# EAGLE design wander-v7 (EAGLE 9.4.2)
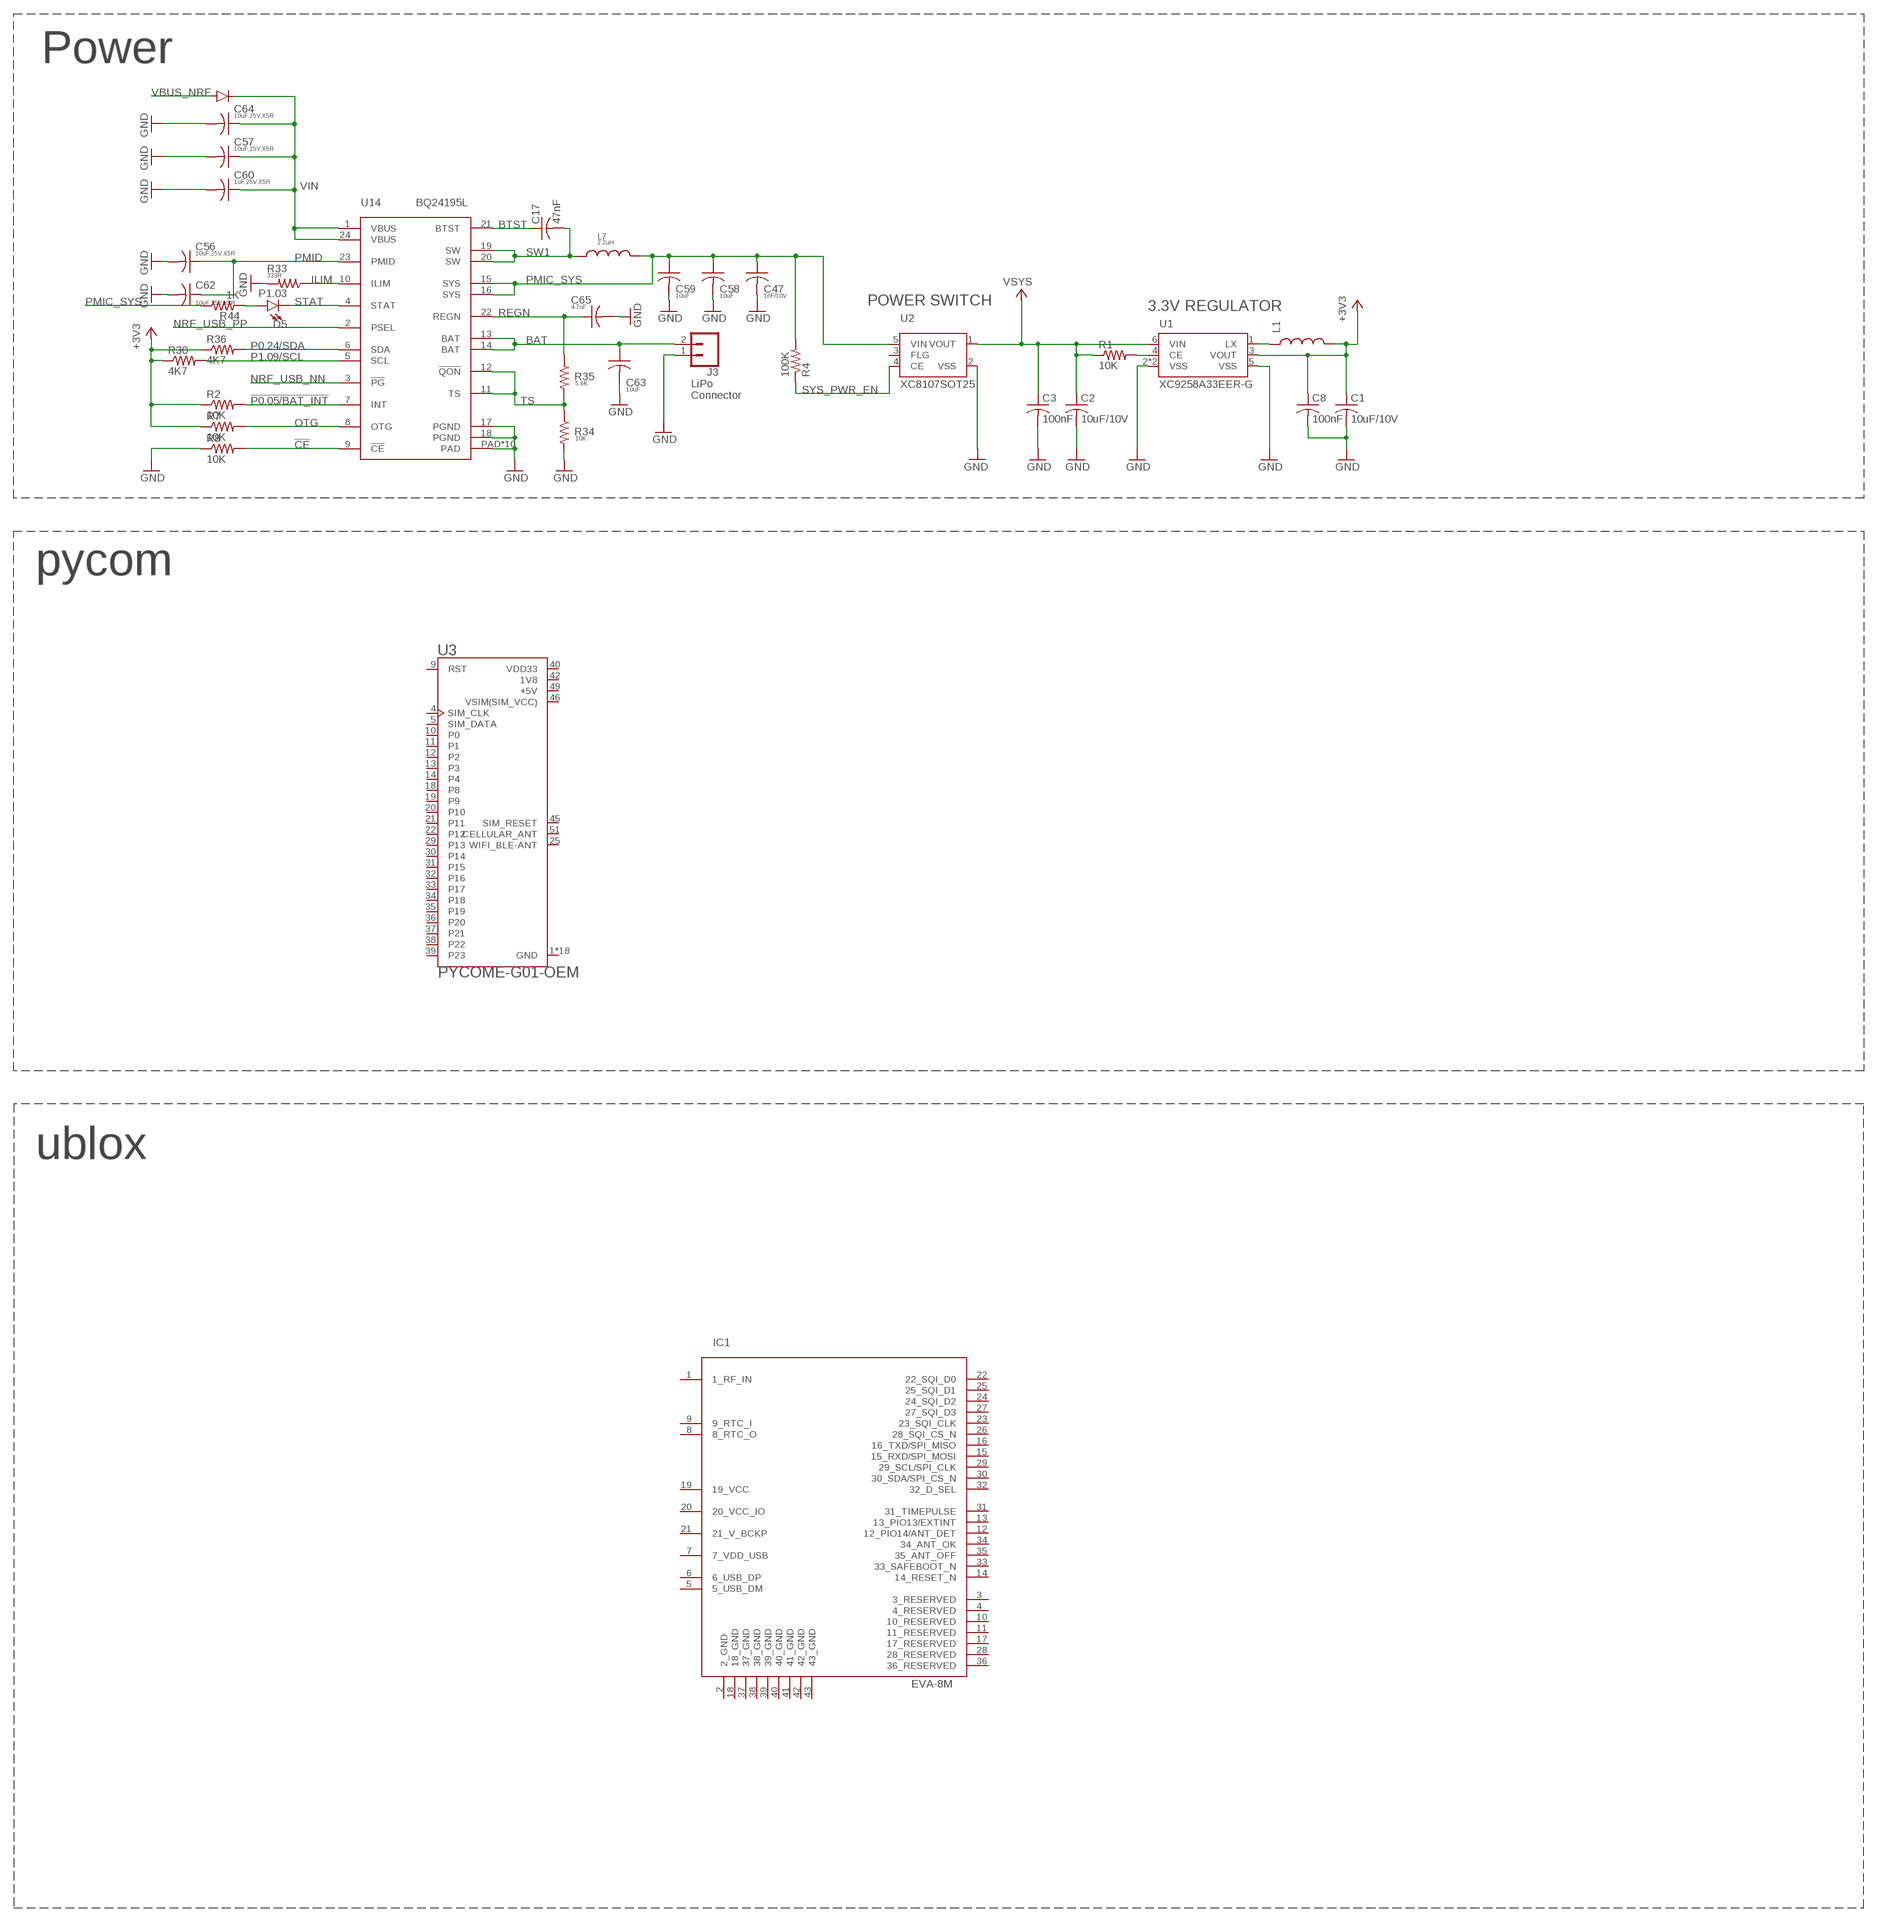
[diagram p0: schematic, sheet 1, part 1 of 2]
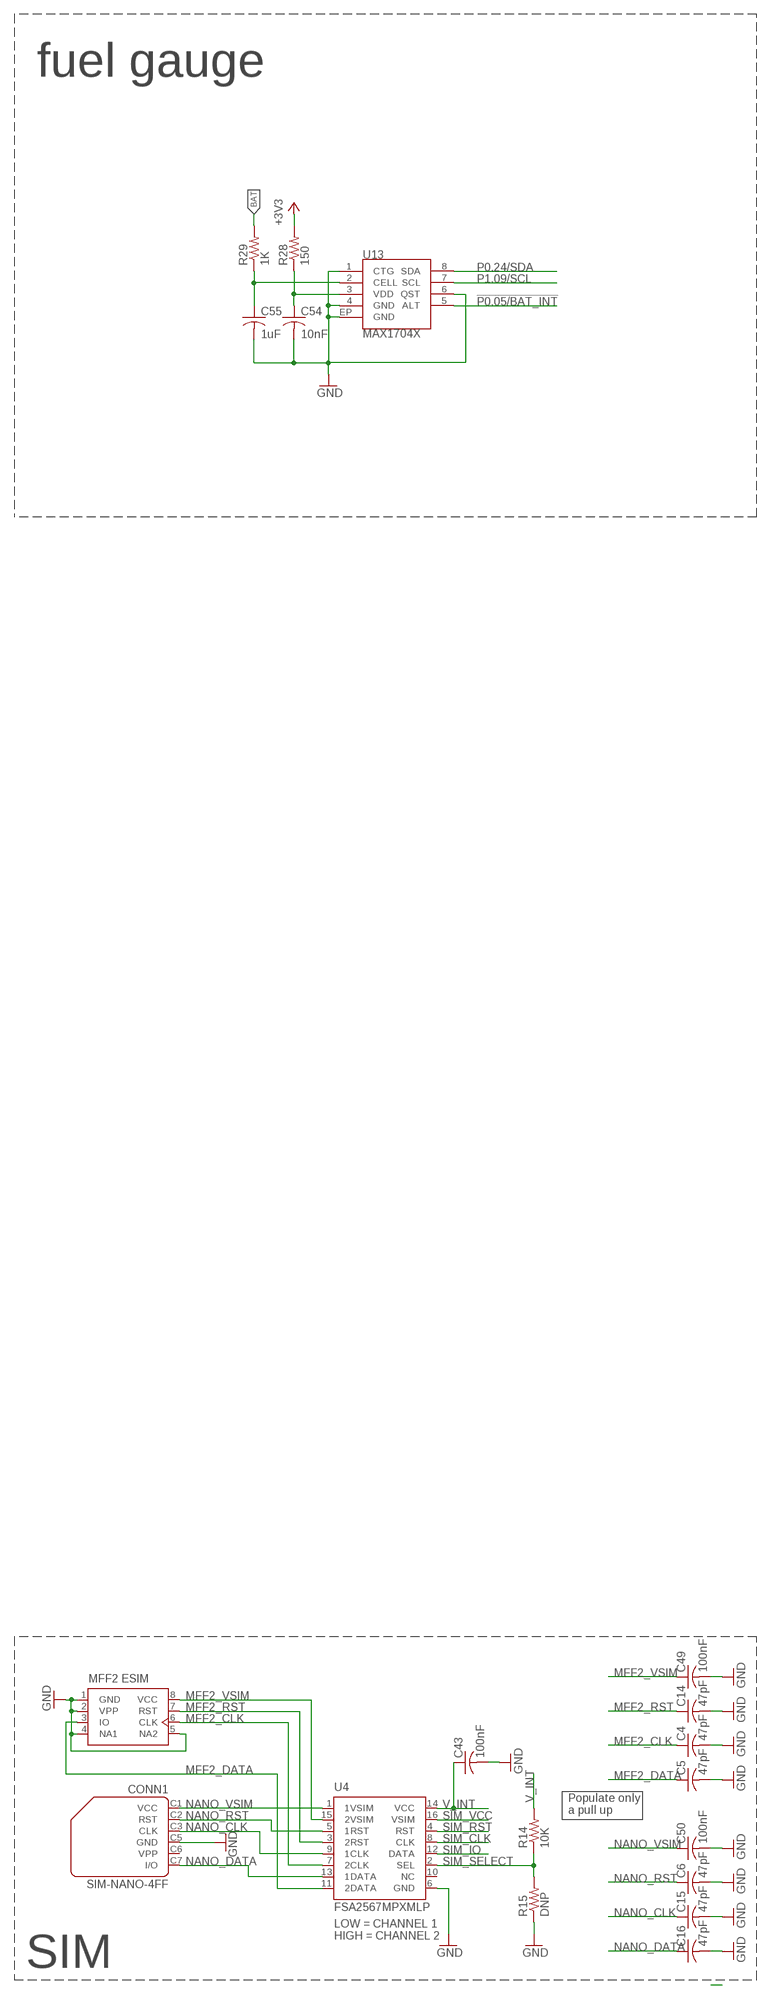
[diagram p1: schematic, sheet 1, part 2 of 2]

## Parts
C1  10uF/10V  C-USC0603K  [C0603K]
C2  10uF/10V  C-USC0603K  [C0603K]
C3  100nF  C-USC0603K  [C0603K]
C4  47pF  C-USC0201_B  [C0201_B]
C5  47pF  C-USC0201_B  [C0201_B]
C6  47pF  C-USC0201_B  [C0201_B]
C8  100nF  C-USC0201_B  [C0201_B]
C14  47pF  C-USC0201_B  [C0201_B]
C15  47pF  C-USC0201_B  [C0201_B]
C16  47pF  C-USC0201_B  [C0201_B]
C17  47nF  C-USC0201_B  [C0201_B]
C43  100nF  C-USC0201_B  [C0201_B]
C47  1nF/10V  C-US0402  [C0402_B]
C49  100nF  C-USC0201_B  [C0201_B]
C50  100nF  C-USC0201_B  [C0201_B]
C54  10nF  C-US  [C0402_B]
C55  1uF  C-US  [C0402_B]
C56  10uF,25V,X5R  C-US0603  [C0603_B]
C57  10uF,25V,X5R  C-US0603  [C0603_B]
C58  10uF  C-US0603  [C0603_B]
C59  10uF  C-US0603  [C0603_B]
C60  1uF,25V,X5R  C-US0603  [C0603_B]
C62  10uF,25V,X5R  C-US0603  [C0603_B]
C63  10uF  C-US0603  [C0603_B]
C64  10uF,25V,X5R  C-US0603  [C0603_B]
C65  4.7uF  C-US0603  [C0603_B]
CONN1  SIM-NANO-4FF  [GCT-SIM8100]
D4  DIODE_NT  [DIODE-DO-220AA_NT(SMP)]
D5  P1.03  LED-RED0603  [LED-0603]
IC1  EVA-8M  [EVA-8M]
J3  CONN_02-JST-2MM-SMT  [JST-2-SMD@2]
L1  INDUCTOR-SPARKFUNVLS3012ET-4R7M  [INDUCTOR-VLS-E]
L7  2.2uH  INDUCTORI  [INDUCTOR-4040]
R1  10K  R-US_R0201_B  [C0201_B]
R2  10K  R-US_R0201_B  [C0201_B]
R4  100K  R-US_R0201_B  [C0201_B]
R7  10K  R-US_R0201_B  [C0201_B]
R8  10K  R-US_R0201_B  [C0201_B]
R14  10K  R-US_R0201_B  [C0201_B]
R15  DNP  R-US_R0201_B  [C0201_B]
R28  150  RESISTOR0402-RES  [0402-RES]
R29  1K  RESISTOR0402-RES  [0402-RES]
R30  4K7  R-US_R0201_B  [C0201_B]
R33  333R  R-US_  [R0402_B]
R34  10K  R-US_  [R0402_B]
R35  5.6K  R-US_  [R0402_B]
R36  4K7  R-US_R0201_B  [C0201_B]
R44  1K  R-US_R0201_B  [C0201_B]
U1  XC9258A33EER-G  [USP-6C]
U2  XC8107SOT25  [SOT25]
U3  PYCOME-G01-OEM  [PYCOM_PYCOME-G01-OEM]
U4  FSA2567MPXMLP  [MLP16]
U7  ESIMSON8  [MFF2]
U13  MAX1704X  [TDFN-8]
U14  BQ24195L  BQ24298RTWR  [QFN24]

## Nets
!CE: R8.2 U14.9(!CE)
!P0.05/BAT_INT: R2.2 U13.5(ALT) U14.7(INT)
+3V3: C1.1 C8.1 L1.P$2 R2.1 R7.1 R28.2 R30.1 R36.1 U1.3(VOUT)
BAT [BAT]: C63.1 J3.2 R29.2 U14.13(BAT) U14.14(BAT)
BTST: C17.1 U14.21(BTST)
GND: C1.2 C2.2 C3.2 C4.2 C5.2 C6.2 C8.2 C14.2 C15.2 C16.2 C43.2 C47.2 C49.2 C50.2 C54.2 C55.2 C56.2 C57.2 C58.2 C59.2 C60.2 C62.2 C63.2 C64.2 C65.2 CONN1.C5(GND) J3.1 R8.1 R15.1 R33.2 R34.2 U1.2(VSS) U1.5(VSS) U1.P$1(VSS) U2.2(VSS) U4.6(GND) U7.1(GND) U7.2(VPP) U7.4(NA1) U7.5(NA2) U13.1(CTG) U13.4(GND) U13.6(QST) U13.EP(GND) U14.17(PGND) U14.18(PGND) U14.PAD U14.PAD@1(PAD) U14.PAD@2(PAD) U14.PAD@3(PAD) U14.PAD@4(PAD) U14.PAD@5(PAD) U14.PAD@6(PAD) U14.PAD@7(PAD) U14.PAD@8(PAD) U14.PAD@9(PAD)
ILIM: R33.1 U14.10(ILIM)
MFF2_CLK: C4.1 U4.7(2CLK) U7.6(CLK)
MFF2_DATA: C5.1 U4.11(2DATA) U7.3(IO)
MFF2_RST: C14.1 U4.3(2RST) U7.7(RST)
MFF2_VSIM: C49.1 U4.15(2VSIM) U7.8(VCC)
N$16: D5.A R44.1
N$23: R1.2 U1.4(CE)
N$25: L1.P$1 U1.1(LX)
N$41: C54.1 R28.1 U13.3(VDD)
N$42: C55.1 R29.1 U13.2(CELL)
NANO_CLK: C15.1 CONN1.C3(CLK) U4.9(1CLK)
NANO_DATA: C16.1 CONN1.C7(I/O) U4.13(1DATA)
NANO_RST: C6.1 CONN1.C2(RST) U4.5(1RST)
NANO_VSIM: C50.1 CONN1.C1(VCC) U4.1(1VSIM)
NRF_USB_NN: U14.3(!PG)
NRF_USB_PP: U14.2(PSEL)
OTG: R7.2 U14.8(OTG)
P0.24/SDA: R36.2 U13.8(SDA) U14.6(SDA)
P1.09/SCL: R30.2 U13.7(SCL) U14.5(SCL)
PMIC_SYS: C47.1 C58.1 C59.1 L7.P$2 R4.2 R44.2 U2.5(VIN) U14.15(SYS) U14.16(SYS)
PMID: C56.1 C62.1 U14.23(PMID)
REGN: C65.1 R35.1 U14.22(REGN)
SIM_CLK: U4.8(CLK)
SIM_IO: U4.12(DATA)
SIM_RST: U4.4(RST)
SIM_SELECT: R14.1 R15.2 U4.2(SEL)
SIM_VCC: U4.16(VSIM)
STAT: D5.C U14.4(STAT)
SW1: C17.2 L7.P$1 U14.19(SW) U14.20(SW)
SYS_PWR_EN: R4.1 U2.4(CE)
TS: R34.1 R35.2 U14.11(TS) U14.12(!QON)
V_INT: C43.1 R14.2 U4.14(VCC)
VBUS_NRF: D4.ANODE
VIN [vcc]: C57.1 C60.1 C64.1 D4.CATHODE U14.1(VBUS) U14.24(VBUS)
VSYS: C2.1 C3.1 R1.1 U1.6(VIN) U2.1(VOUT)
Unconnected: CONN1.C6(VPP) IC1.1(1_RF_IN) IC1.2(2_GND) IC1.3(3_RESERVED) IC1.4(4_RESERVED) IC1.5(5_USB_DM) IC1.6(6_USB_DP) IC1.7(7_VDD_USB) IC1.8(8_RTC_O) IC1.9(9_RTC_I) IC1.10(10_RESERVED) IC1.11(11_RESERVED) IC1.12(12_PIO14/ANT_DET) IC1.13(13_PIO13/EXTINT) IC1.14(14_RESET_N) IC1.15(15_RXD/SPI_MOSI) IC1.16(16_TXD/SPI_MISO) IC1.17(17_RESERVED) IC1.18(18_GND) IC1.19(19_VCC) IC1.20(20_VCC_IO) IC1.21(21_V_BCKP) IC1.22(22_SQI_D0) IC1.23(23_SQI_CLK) IC1.24(24_SQI_D2) IC1.25(25_SQI_D1) IC1.26(28_SQI_CS_N) IC1.27(27_SQI_D3) IC1.28(28_RESERVED) IC1.29(29_SCL/SPI_CLK) IC1.30(30_SDA/SPI_CS_N) IC1.31(31_TIMEPULSE) IC1.32(32_D_SEL) IC1.33(33_SAFEBOOT_N) IC1.34(34_ANT_OK) IC1.35(35_ANT_OFF) IC1.36(36_RESERVED) IC1.37(37_GND) IC1.38(38_GND) IC1.39(39_GND) IC1.40(40_GND) IC1.41(41_GND) IC1.42(42_GND) IC1.43(43_GND) U2.3(FLG) U3.4(SIM_CLK) U3.5(SIM_DATA) U3.9(RST) U3.10(P0) U3.11(P1) U3.12(P2) U3.13(P3) U3.14(P4) U3.18(P8) U3.19(P9) U3.20(P10) U3.21(P11) U3.22(P12) U3.25(WIFI_BLE-ANT) U3.29(P13) U3.30(P14) U3.31(P15) U3.32(P16) U3.33(P17) U3.34(P18) U3.35(P19) U3.36(P20) U3.37(P21) U3.38(P22) U3.39(P23) U3.45(SIM_RESET) U3.51(CELLULAR_ANT) U4.10(NC)

## Notes on the sheet
- Power | fuel gauge
- POWER SWITCH
- 3.3V REGULATOR
- LiPo
  Connector
- pycom
- ublox
- MFF2 ESIM
- Populate only 
  a pull up
- LOW = CHANNEL 1
  HIGH = CHANNEL 2
- SIM

## Power pins joined to a net without a drawn wire
1V8: U3.42(1V8)
+5V: U3.49(+5V)
GND: U3.1(GND) U3.2(GND) U3.3(GND) U3.6(GND) U3.7(GND) U3.8(GND) U3.23(GND) U3.24(GND) U3.26(GND) U3.27(GND) U3.28(GND) U3.41(GND) U3.43(GND) U3.44(GND) U3.47(GND) U3.48(GND) U3.50(GND) U3.52(GND)
VDD33: U3.40(VDD33)
VSIM(SIM_VCC): U3.46(VSIM(SIM_VCC))

## Library data of the parts
C1-C3 = rcl:C-US: CAPACITOR, American symbol
C4-C6 C8 C14-C17 C43 C49 C50 = Particle:C-US: Capacitor
C47 C56-C60 C62-C65 = Bretts-Spark-Library:C-US: Capacitor
C54 C55 = Spark:C-US: Capacitor
CONN1 = Particle:SIM-NANO-4FF: SIM NANO 4FF
D4 = Particle:DIODE
D5 = SparkFun-LED:LED-RED: Red SMD LED Used in manufacturing of most products at SparkFun Packages: 0603 - SMD 0603 package [Product Link] <http://docs.avagotech.com/docs/AV02-0551EN> 0603 SMART - SMD 0603 SMART package ( more efficient and expensive)[Product Link] <http://www.osram-os.com/Graphics/XPic2/00077099_0.pdf> 1206 - SMD1206 package [Product Link] <https://www.sparkfun.com/datasheets/DevTools/LilyPad/Q150OVS4.pdff> SparkFun Products: Pro Mini 328 -5V <https://www.sparkfun.com/products/821> RedBoard <https://www.sparkfun.com/products/12757> IOIO-OTG <https://www.sparkfun.com/products/13613>; PROD_ID: DIO-00819; VALUE: RED
IC1 = ubloxLib:EVA-8M: u-blox EVA GNSS module
J3 = SparkFun-Connectors:CONN_02: Multi connection point. Often used as Generic Header-pin footprint for 0.1 inch spaced/style header connections On any of the 0.1 inch spaced packages, you can populate with these: Break Away Headers - Straight <https://www.sparkfun.com/products/116> (PRT-00116) Break Away Male Headers - Right Angle <https://www.sparkfun.com/products/553> (PRT-00553) Female Headers <https://www.sparkfun.com/products/115> (PRT-00115) Break Away Headers - Machine Pin <https://www.sparkfun.com/products/117> (PRT-00117) Break Away Female Headers - Swiss Machine Pin <https://www.sparkfun.com/products/743> (PRT-00743) For SCREWTERMINALS and SPRING TERMINALS visit here: Screw Terimnals on SparkFun.com <https://www.sparkfun.com/search/results?term=Screw+Terminals> (5mm/3.5mm/2.54mm spacing) This device is also useful as a general connection point to wire up your design to another part of your project. Our various solder wires solder well into these plated through hole pads. Hook-Up Wire - Assortment (Stranded, 22 AWG) <https://www.sparkfun.com/products/11375> (PRT-11375) Hook-Up Wire - Assortment (Solid Core, 22 AWG) <https://www.sparkfun.com/products/11367> (PRT-11367) View the entire wire category on our website here <https://www.sparkfun.com/categories/141> Special notes: Molex polarized connector foot print use with: PRT-08233 with associated crimp pins and housings. 2.54_SCREWTERM for use with PRT-10571. 3.5mm Screw Terminal footprints for PRT-08084 5mm Screw Terminal footprints for use with PRT-08432; PROD_ID: CONN-11443
L1 = Particle:INDUCTOR-SPARKFUN: Inductors Basic Inductor/Choke - 0603 and 1206. Footprints are not proven and vary greatly between part numbers. SRN6045- 33uH, 20% 1.4A
L7 = Particle:INDUCTOR
R1 R2 R4 R7 R8 R14 R15 R30 R36 R44 = Particle:R-US_: 0402 Resistor
R28 R29 = SparkFun-Passives:RESISTOR: Resistor Basic schematic elements and footprints for 0603, 1206, and PTH resistors.
R33-R35 = Spark:R-US_: 0402 Resistor
U1 = Particle:XC9258: 1.0A Synchronous Step-Down DC/DC Converters
U2 = Particle:XC8107
U3 = Pycom G01:PYCOME-G01-OEM: The G01 is the GPy OEM module. It’s just like the GPy but with a few bits less to make it easy to integrate. Triple network module: Cellular LTE-CAT M1/NB1, WiFi and Bluetooth.; AVAILABILITY: Unavailable; MF: Pycom; MP: PYCOME-G01-OEM; PACKAGE: None; PRICE: None
U4 = Particle:FSA2567MPX: Low power dual SIM card analog switch
U7 = Particle:ESIM
U13 = SparkFun-PowerIC:MAX1704X: MAX17043/MAX17044: Battery Fuel Guage (43 is 1cell, 44 is 2cell)
U14 = electron:BQ24298RTWR: Bq24298 I2C Controlled 3A Single Cell USB Charger with Narrow VDC Power Path Management and Adjustable Voltage USB OTG

## Net classes
0 default: width 0.152 mm, clearance 0.152 mm
2 RF: width 0.33 mm, clearance 0.191 mm
3 BAT: clearance 0.203 mm
6 +3V3: width 0.152 mm, clearance 0.152 mm

## Board
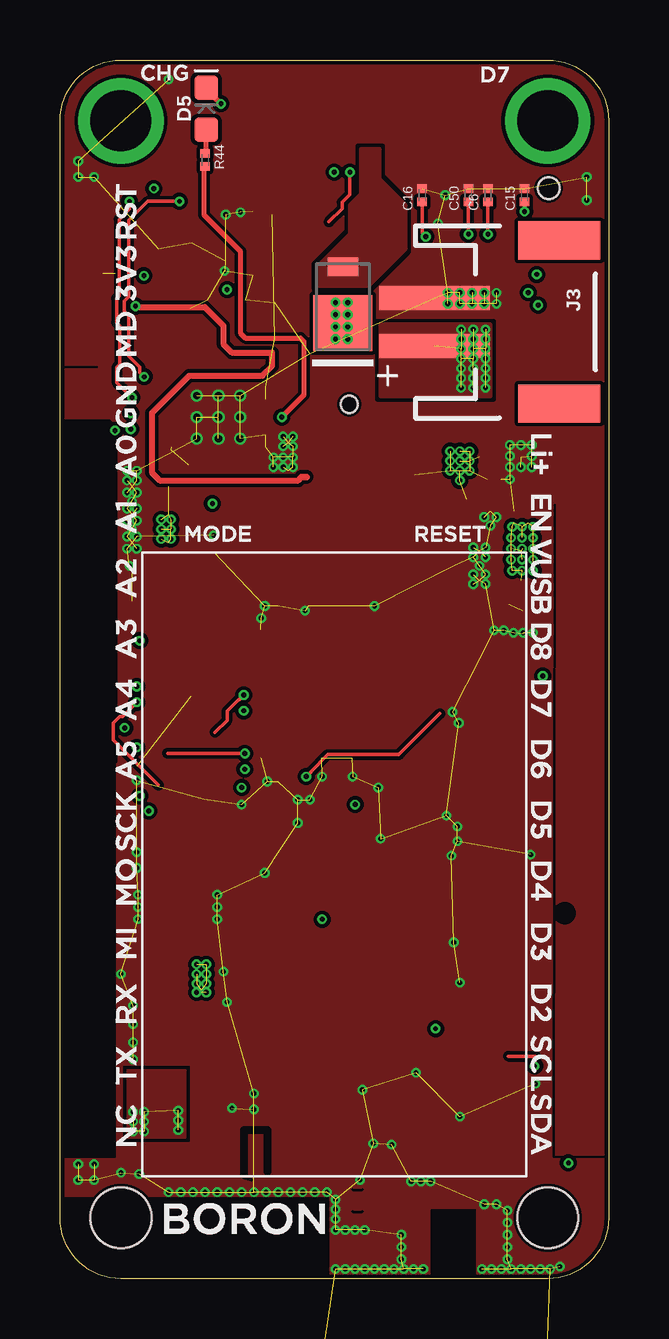
[diagram p2: board, top side]
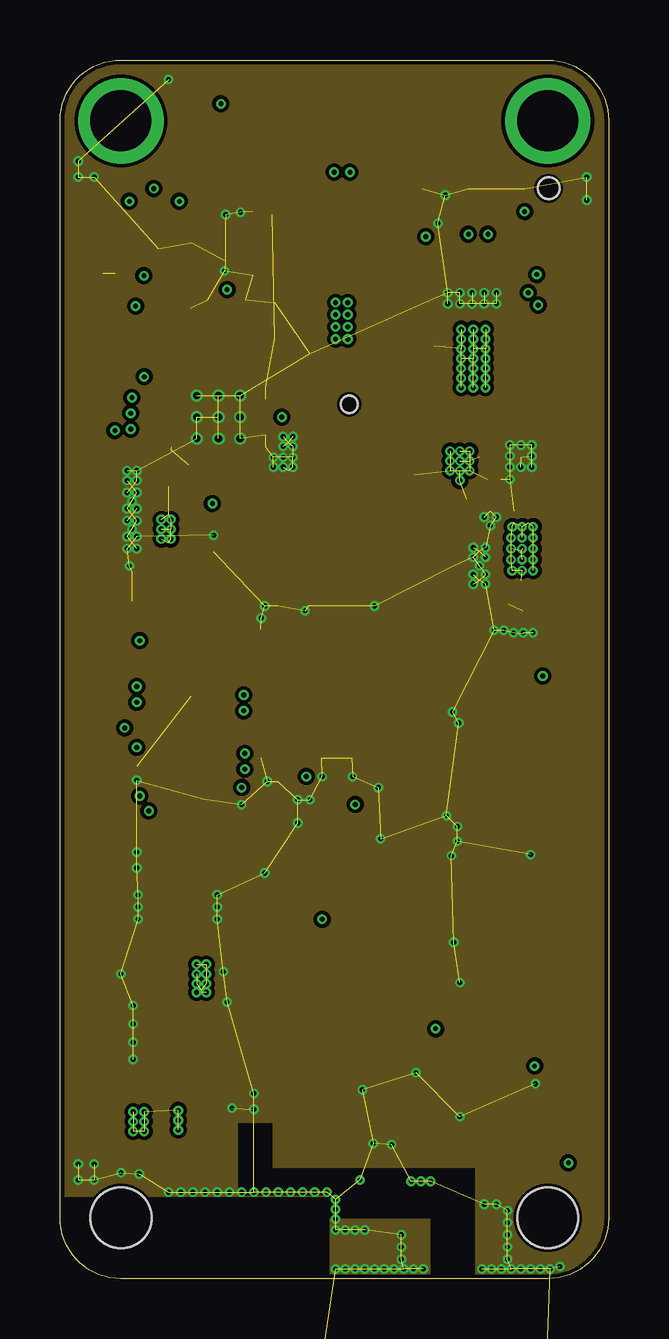
[diagram p3: board, inner layer Layer2-gnd]
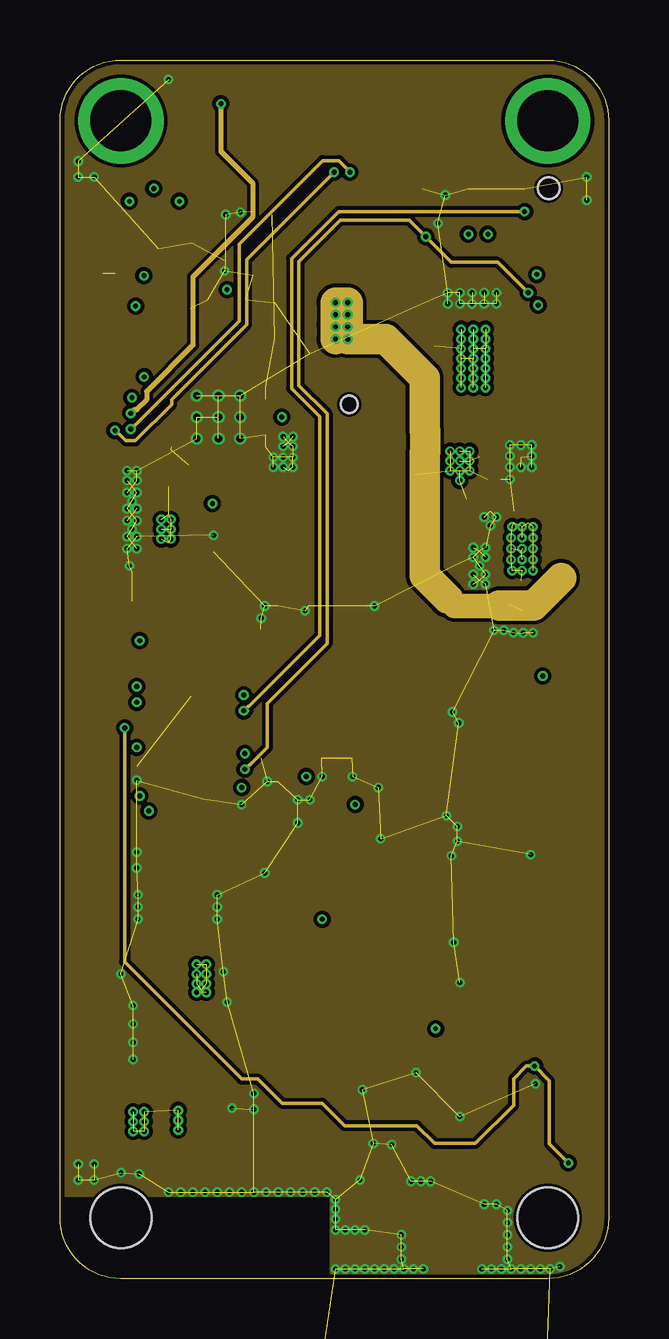
[diagram p4: board, inner layer Layer3-signal]
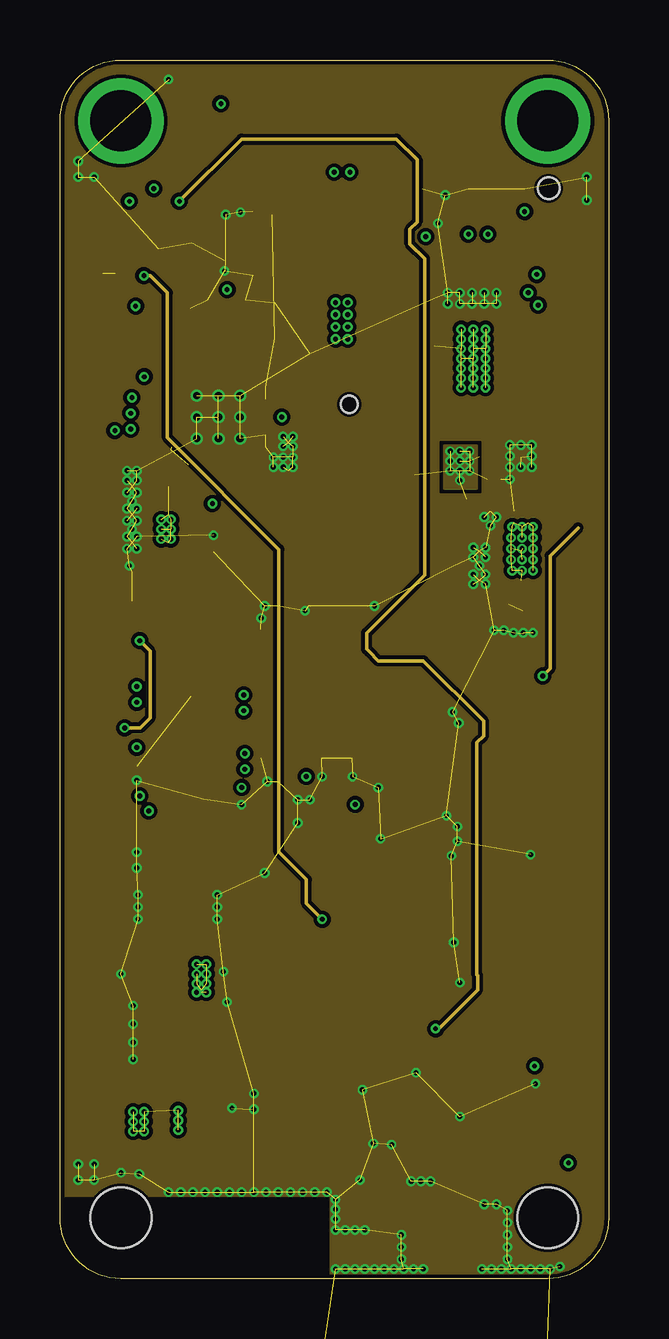
[diagram p5: board, inner layer Layer4-signal]
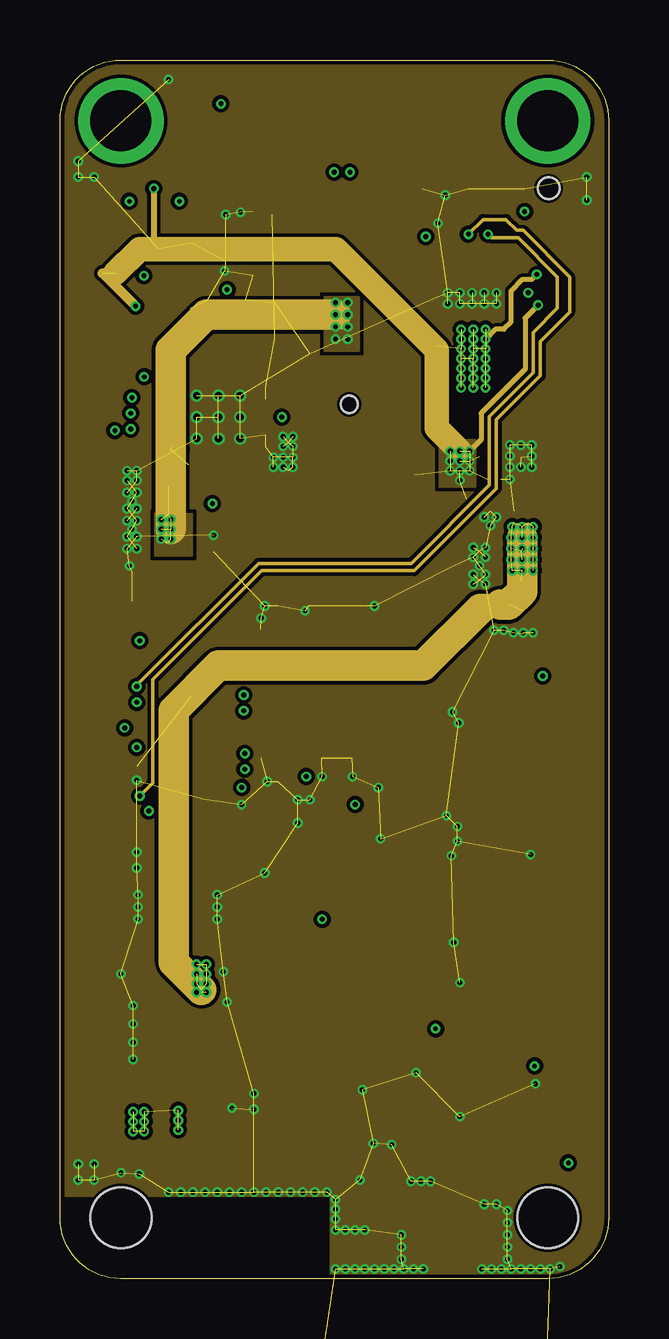
[diagram p6: board, inner layer Layer5-signal]
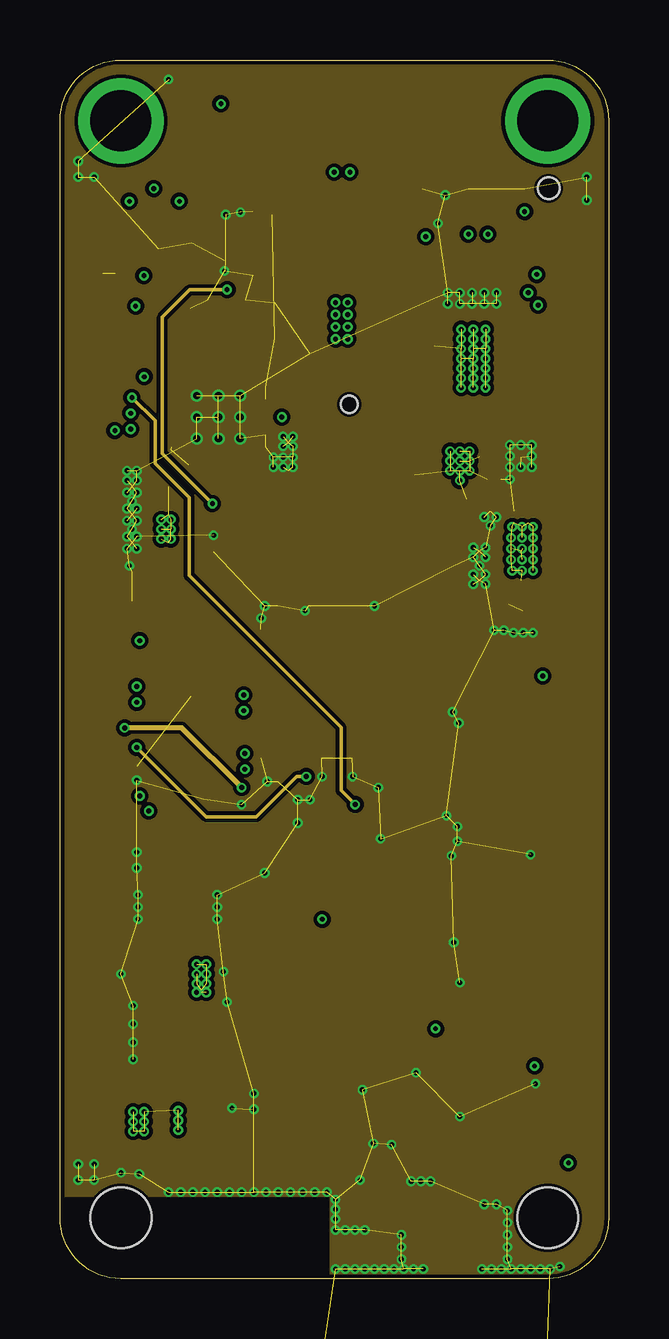
[diagram p7: board, inner layer Layer6-signal]
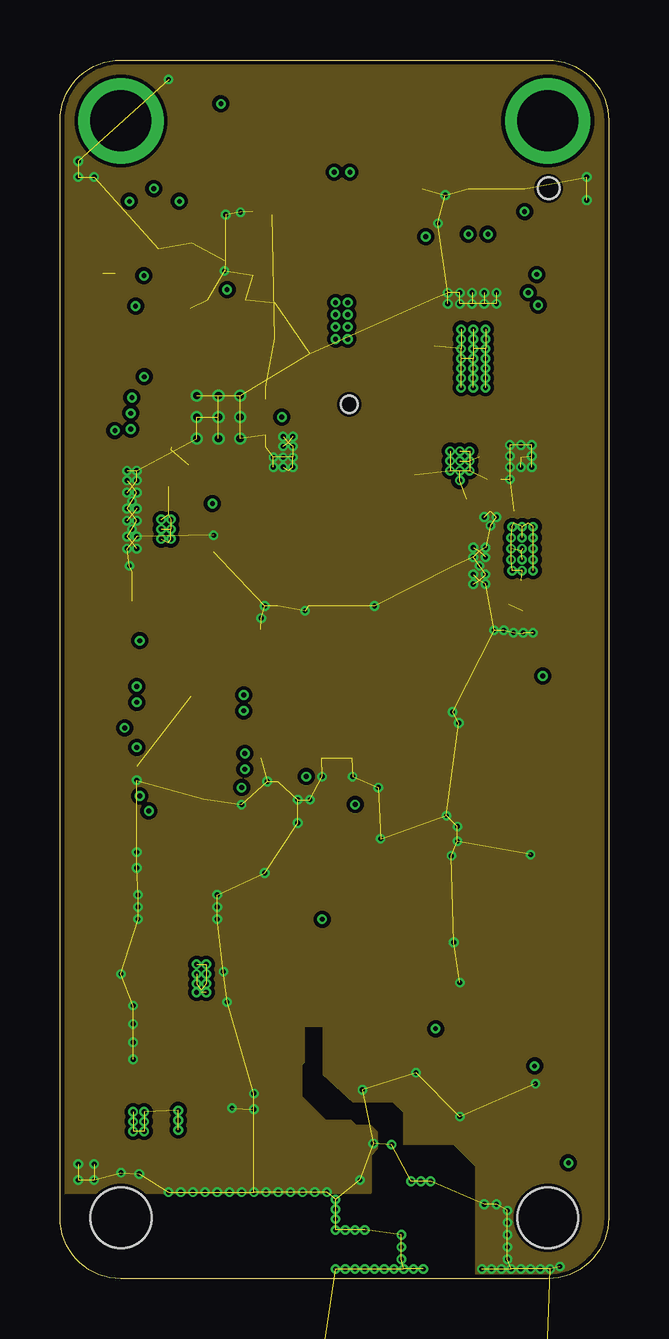
[diagram p8: board, inner layer Layer7-gnd]
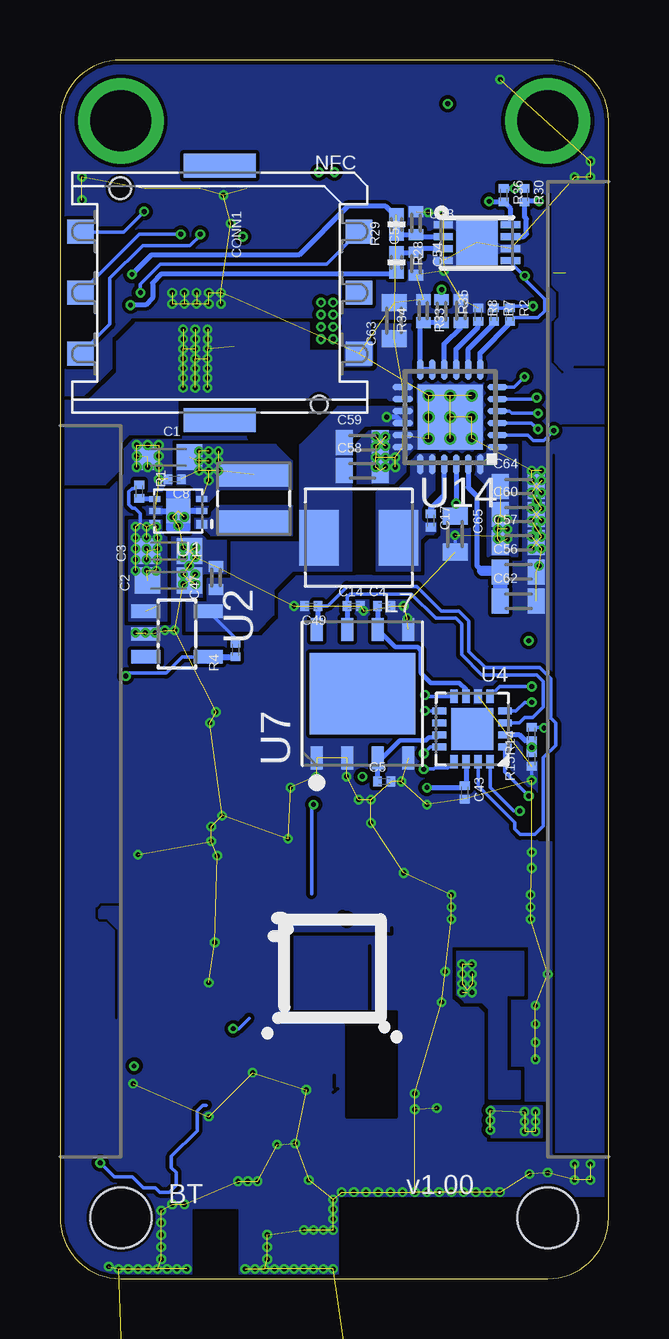
[diagram p9: board, bottom side, seen from below]

Size 22.86 x 50.8 mm. Coordinates in mm from the lower left corner, seen from the top.
Outline: 22.86,48.26 22.86,2.54 arc-90 20.32,0 2.54,0 arc-90 0,2.54 0,48.26 arc-90 2.54,50.8 20.32,50.8 arc-90 22.86,48.26
Copper layers (1+2+3+4+5+6+7+16): Top 0.018mm / dielectric 0.195mm / Layer2-gnd 0.035mm / dielectric 1.1mm / Layer3-signal 0.035mm / dielectric 0.2mm / Layer4-signal 0.035mm / dielectric 0.15mm / Layer5-signal 0.035mm / dielectric 0.2mm / Layer6-signal 0.035mm / dielectric 0.15mm / Layer7-gnd 0.035mm / dielectric 0.2mm / Bottom 0.018mm
Design rules "spark-4layer *": minimum track width 4mil, minimum drill 0.2mm, track to track 6mil, track to pad 6mil, pad to pad 6mil, via to via 6mil, smd to smd 0mil, copper to edge 6mil, drill to drill 6mil, minimum pad ring 4mil, minimum via ring 4mil, stop-mask expansion 0.01mm, vias tented up to drill 16mil, thermal gap 4mil
Holes 2.54 mm at 20.32,2.54 2.54,2.54
tKeepout: 5 lines
tRestrict: area 0,-0.1 to 11.2,3.4; area 15.4,0 to 17.3,2.9; area 20.7,14.9 to 21.4,15.6; 14 lines
bRestrict: area 0,-0.1 to 11.2,3.4; area 15.4,0 to 17.3,2.9; area 8.8,6.8 to 10.9,11.1; 37 lines

### Footprints (pad centres in the part's own frame; a part is rotated, then mirrored left to right if it is on the bottom)
C0603K = smd 1.05 x 1.08: 1 -0.875,0; 2 0.875,0
C0201_B = smd 0.356 x 0.406: 1 -0.279,0; 2 0.279,0
C0402_B = smd 0.457 x 0.61: 1 -0.483,0; 2 0.483,0
C0603_B = smd 0.711 x 1.041: 1 -0.749,0; 2 0.749,0
GCT-SIM8100 = smd 1 x 1.1: C1 2.54,-5.8; C2 0,-5.8; C3 -2.54,-5.8; C5 2.54,5.8; C6 0,5.8; C7 -2.54,5.8 | smd 1 x 3: NC@1 -5.3,0; NC@2 5.3,0 | hole 0.7: 4.65,4.15 | hole 0.9: -4.35,-4.15
DIODE-DO-220AA_NT(SMP) = smd 0.762 x 1.27: ANODE 2.349,0 | smd 2.337 x 2.464: CATHODE 0,0
LED-0603 = smd 1 x 1: A -0.877,0; C 0.877,0
EVA-8M = smd 0.4 x 0.3: 1 -3.15,2.6; 2 -3.15,1.95; 3 -3.15,1.3; 4 -3.15,0.65; 5 -3.15,0; 6 -3.15,-0.65; 7 -3.15,-1.3; 8 -3.15,-1.95; 9 -3.15,-2.6; 19 3.15,-2.6; 20 3.15,-1.95; 21 3.15,-1.3; 22 3.15,-0.65; 23 3.15,0; 24 3.15,0.65; 25 3.15,1.3; 26 3.15,1.95; 27 3.15,2.6 | smd 0.3 x 0.4: 10 -2.6,-3.15; 11 -1.95,-3.15; 12 -1.3,-3.15; 13 -0.65,-3.15; 14 0,-3.15; 15 0.65,-3.15; 16 1.3,-3.15; 17 1.95,-3.15; 18 2.6,-3.15; 28 2.6,3.15; 29 1.95,3.15; 30 1.3,3.15; 31 0.65,3.15; 32 0,3.15; 33 -0.65,3.15; 34 -1.3,3.15; 35 -1.95,3.15; 36 -2.6,3.15 | smd 0.5 x 0.5: 37 -1.3,1.3; 38 0,1.3; 39 -1.3,0; 40 0,0; 41 -1.3,-1.3; 42 0,-1.3; 43 1.3,-1.3
JST-2-SMD@2 = smd 1 x 4.6: 1 -1,-3.7; 2 1,-3.7 | smd 1.6 x 3.4: NC1 -3.4,1.5; NC2 3.4,1.5
INDUCTOR-VLS-E = smd 1 x 3: P$1 -1,0; P$2 1,0
INDUCTOR-4040 = smd 1.65 x 2.3: P$1 -1.65,0; P$2 1.65,0
0402-RES = smd 0.55 x 0.6: 1 -0.4,0; 2 0.4,0
R0402_B = smd 0.457 x 0.61: 1 -0.483,0; 2 0.483,0
USP-6C = smd 0.45 x 0.35: 1 -0.975,0.55 | smd 0.45 x 0.25: 2 -0.975,0; 3 -0.975,-0.5; 4 0.975,-0.5; 5 0.975,0; 6 0.975,0.5 | smd 1.016 x 1.016: P$1 0,0
SOT25 = smd 0.55 x 1.2: 1 -0.95,-1.3; 2 0,-1.3; 3 0.95,-1.3; 4 0.95,1.3; 5 -0.95,1.3
PYCOM_PYCOME-G01-OEM = smd 0.8 x 1.85: 1 -18.015,-8.4; 2 -14.895,-8.4; 3 -13.895,-8.4; 4 -10.775,-8.4; 5 -9.775,-8.4; 6 -6.655,-8.4; 7 -5.655,-8.4; 8 2.795,-8.4; 9 3.795,-8.4; 10 4.795,-8.4; 11 5.795,-8.4; 12 6.795,-8.4; 13 7.795,-8.4; 14 8.795,-8.4; 15 9.795,-8.4; 16 10.795,-8.4; 17 11.795,-8.4; 18 12.795,-8.4; 19 13.795,-8.4; 20 14.795,-8.4; 21 15.795,-8.4; 22 16.795,-8.4; 23 17.795,-8.4; 27 17.795,8.4; 28 16.795,8.4; 29 15.795,8.4; 30 14.795,8.4; 31 13.795,8.4; 32 12.795,8.4; 33 11.795,8.4; 34 10.795,8.4; 35 9.795,8.4; 36 8.795,8.4; 37 7.795,8.4; 38 6.795,8.4; 39 5.795,8.4; 40 4.795,8.4; 41 3.795,8.4; 42 2.795,8.4; 43 -5.655,8.4; 44 -6.655,8.4; 45 -9.775,8.4; 46 -10.775,8.4; 47 -13.895,8.4; 48 -14.895,8.4 | smd 1.85 x 0.8: 24 20.91,-3.605; 25 20.91,-2.605; 26 20.91,-1.605; 50 -20.91,-0.691; 51 -20.91,-1.691; 52 -20.91,-2.691 | smd 1 x 1.85: 49 -18.015,8.4
MLP16 = smd 0.57 x 0.3: 1 -1.365,0.75; 2 -1.365,0.25; 3 -1.365,-0.25; 4 -1.365,-0.75; 9 1.365,-0.75; 10 1.365,-0.25; 11 1.365,0.25; 12 1.365,0.75 | smd 0.3 x 0.57: 5 -0.75,-1.365; 6 -0.25,-1.365; 7 0.25,-1.365; 8 0.75,-1.365; 13 0.75,1.365; 14 0.25,1.365; 15 -0.25,1.365; 16 -0.75,1.365 | smd 1.75 x 1.75: P$1 0,0
MFF2 = smd 0.96 x 0.5: 1 -2.675,1.905; 2 -2.675,0.635; 3 -2.675,-0.635; 4 -2.675,-1.905; 5 2.675,-1.905; 6 2.675,-0.635; 7 2.675,0.635; 8 2.675,1.905 | smd 3.4 x 4.4: P$1 0,0
TDFN-8 = smd 0.8 x 0.3: 1 -1.4,0.75; 2 -1.4,0.25; 3 -1.4,-0.25; 4 -1.4,-0.75; 5 1.4,-0.75; 6 1.4,-0.25; 7 1.4,0.25; 8 1.4,0.75 | smd 1.73 x 1.88: EP 0,0
QFN24 = smd 0.85 x 0.28: 1 -1.975,1.25; 2 -1.975,0.75; 3 -1.975,0.25; 4 -1.975,-0.25; 5 -1.975,-0.75; 6 -1.975,-1.25; 13 1.975,-1.25; 14 1.975,-0.75; 15 1.975,-0.25; 16 1.975,0.25; 17 1.975,0.75; 18 1.975,1.25 | smd 0.28 x 0.85: 7 -1.25,-1.975; 8 -0.75,-1.975; 9 -0.25,-1.975; 10 0.25,-1.975; 11 0.75,-1.975; 12 1.25,-1.975; 19 1.25,1.975; 20 0.75,1.975; 21 0.25,1.975; 22 -0.25,1.975; 23 -0.75,1.975; 24 -1.25,1.975 | smd 2.7 x 2.7: PAD 0,0 | drill 0.3 pad 0.406: PAD@1 -0.9,0.9; PAD@2 0,0.9; PAD@3 0.9,0.9; PAD@4 -0.9,0; PAD@5 0,0; PAD@6 0.9,0; PAD@7 -0.9,-0.9; PAD@8 0,-0.9; PAD@9 0.9,-0.9

### Placement (x,y rotation side)
C1  18.34,34.24 180 bottom
C2  18.34,29.11 0 bottom
C3  18.34,30.33 0 bottom
C4  9.35,28.04 0 bottom
C5  9.35,20.73 0 bottom
C6  17.83,45.16 90 top
C8  18.08,33.32 180 bottom
C14  10.62,28.04 0 bottom
C15  19.35,45.16 90 top
C16  15.09,45.16 90 top
C17  7.42,31.6 270 bottom
C43  5.99,20.27 270 bottom
C47  16.36,29.21 90 bottom
C49  12.4,28.04 180 bottom
C50  17.02,45.16 90 top
C54  8.03,42.32 270 bottom
C55  8.03,43.99 90 bottom
C56  3.76,29.46 0 bottom
C57  3.76,30.68 0 bottom
C58  10.26,33.68 0 bottom
C59  10.26,34.85 0 bottom
C60  3.76,31.85 0 bottom
C62  3.76,28.24 0 bottom
C63  8.94,39.93 90 bottom
C64  3.76,33.02 0 bottom
C65  6.4,31.04 270 bottom
CONN1  16.21,41.1 270 bottom
D4  11.79,39.83 90 top
D5  6.1,48.77 90 top
IC1  -1.47,-28.3 0 top  (outside the outline)
J3  19.3,39.88 270 top
L1  14.78,32.51 90 bottom
L7  10.41,30.89 180 bottom
R1  19.56,32.82 270 bottom
R2  4.11,40.18 270 bottom
R4  15.54,26.21 90 bottom
R7  4.78,40.18 270 bottom
R8  5.44,40.18 270 bottom
R14  3.2,22.71 90 bottom
R15  3.2,21.64 90 bottom
R28  8.84,42.37 270 bottom
R29  8.84,43.94 90 bottom
R30  3.51,45.16 270 bottom
R33  6.15,40.34 90 bottom
R34  7.72,40.34 90 bottom
R35  6.96,40.34 270 bottom
R36  4.37,45.16 270 bottom
R44  6.05,46.63 270 top
U1  17.93,32 180 bottom
U2  17.98,26.87 270 bottom
U3  16.46,-12.6 0 top  (outside the outline)
U4  5.69,22.91 180 bottom
U7  10.26,24.38 90 bottom
U13  5.49,43.18 0 bottom
U14  6.6,35.92 180 bottom

### Tracks (layer width: path | path; a pad name or v marks a point on that pad's centre or on a via)
!CE
  Bottom 0.203: U14.9 6.35,38.75 5.44,39.67 R8.2
!P0.05/BAT_INT  (via drill 0.2)
  Layer4-signal 0.152: v3.5,41.8 3.76,41.8 4.47,41.1 4.47,35.05 9.12,30.4 9.12,17.78 10.26,16.64 10.26,15.65 v10.92,14.99
  Bottom 0.152: 11.08,15.15 v10.92,14.99 | R2.2 3.96,40.06 2.95,40.06 2.67,40.34 2.67,40.84 3.5,41.67 v3.5,41.8 3.51,41.82 3.54,41.82 4.09,42.36 U13.5
  Bottom 0.203: U14.7 5.35,38.58 4.12,39.82 R2.2
+3V3  (via drill 0.2)  (14 unrouted)
  Top 0.254: v3.15,40.54 3.18,40.51 6.02,40.51 6.81,39.72 6.81,38.96 7.16,38.61 8.84,38.61 8.84,38.05 8.43,37.64 5.38,37.64 3.83,36.08 3.83,33.61 4.16,33.27 9.92,33.27 10.06,33.42
  Top 0.279: 10.27,33.42 10.06,33.42
  Layer5-signal 0.203: v16.66,34.09 17.55,34.98 17.55,36.08 19.38,37.91 19.38,40.04 v19.92,40.58
  Layer5-signal 0.254: v3.91,45.44 3.91,43.13 4.12,42.92
  Layer5-signal 0.406: v3.15,40.54 1.78,41.91
  Layer5-signal 1.016: v16.66,34.49 15.7,35.46 15.7,38.71 11.48,42.92 4.12,42.92 3.33,42.92 2.31,41.91
  Bottom 0.152: R7.1 R2.1 4.04,40.54 v3.15,40.54
  Bottom 0.203: R30.1 v3.91,45.44 R36.1 | v19.92,40.58 19.91,40.59 19.3,40.59 19,40.89 19,41.51 18.62,41.88 8.92,41.88 R28.2
  other vias: 17.07,33.68 17.07,34.09 17.07,34.49 16.66,33.68 16.66,33.27 16.26,34.49 16.26,34.09 16.26,33.68
  pour Bottom (no thermals): 17.17,32.41 17.17,32.87 17.37,33.07 17.42,33.12 17.98,33.12 17.98,34.75 13.87,34.75 13.21,34.09 13.21,32.97 13.21,32.92 16.15,32.92 16.66,32.41
  pour Layer4-signal (no thermals): 16,33.02 16,34.75 17.37,34.75 17.37,32.92 16,32.92
  pour Layer5-signal (no thermals): 16,33.02 17.27,33.02 17.32,33.02 17.32,34.95 15.85,34.95 15.8,34.9 15.8,33.02
BAT  (via drill 0.2)  (24 unrouted)
  Layer5-signal 0.203: v19.86,41.86 19.66,41.65 19.28,41.65 18.8,41.17 18.8,39.88 18.49,39.57 18.14,39.57 v17.73,39.17
  Bottom 0.203: R29.2 8.93,44.34 9.3,44.7 10.87,44.7 12.9,42.67 19.05,42.67 v19.86,41.86
  other vias: 17.73,38.76 17.73,38.35 17.73,37.95 17.73,37.54 17.73,37.13 17.22,37.13 17.22,37.54 17.22,37.95 17.22,38.35 17.22,38.76 17.22,39.17 17.22,39.57 16.71,39.57 16.71,39.17 16.71,38.76 16.71,38.35 16.71,37.95 16.71,37.54 16.71,37.13 17.73,39.57
  pour Bottom (rank 2, no thermals): 8.13,36.53 8.13,39.78 9.7,39.78 9.7,37.9 9.8,37.8 11.23,37.8 11.23,38.66 12.5,38.66 12.5,39.83 18.03,39.83 18.03,36.73 9.25,36.73 9.04,36.53
  pour Bottom (no thermals): 22.86,33.12 20.98,33.12 20.62,33.48 20.42,33.68 20.42,34.75 19.96,35.2 17.98,35.2 17.98,39.83 19.71,39.83 20.47,39.07 20.47,37.8 21.59,36.68 21.69,36.58 22.86,36.58
  pour Top (no thermals): 17.93,39.78 13.36,39.78 13.36,36.78 17.93,36.78
BTST
  Bottom 0.203: C17.1 7.42,32.11 6.85,32.67 U14.21
GND  (via drill 0.2)  (251 unrouted)
  Bottom 0.152: R15.1 v3.2,20.78 | C65.2 v6.4,30.99
  Bottom 0.254: U1.5 U1.P$1 U1.2
  other vias: 13.36,18.34 10.41,19.96 9.91,19.96 8.64,20.73 10.92,20.93 12.19,20.93 16.66,12.34 16.56,18.85 16.1,19.3 6.55,16 6.55,15.49 6.55,14.99 3.25,16 3.25,15.49 3.25,14.99 3.05,11.38 3.05,10.62 3.05,9.86 3.05,9.14 6.96,11.53 6.86,42.01 7.52,44.45 6.91,44.35 18.19,40.64 17.68,40.64 17.68,41.1 17.17,40.64 18.19,41.1 17.17,41.1 16.66,41.1 16.66,40.64 16.15,41.1 16.15,40.64 19.66,34.75 19.66,34.29 19.66,33.83 18.75,34.75 18.75,34.29 18.75,33.83 19.2,34.75 19.2,33.83 18.75,33.32 18.19,31.75 17.68,31.75 17.73,28.96 17.73,29.36 17.48,29.72 17.73,30.07 17.73,30.48 17.93,31.39 17.22,30.48 17.22,30.07 17.22,29.36 17.22,28.96 19.71,26.92 19.3,26.92 18.9,26.92 18.49,27.03 18.08,27.03 13.11,28.04 10.21,27.84 8.53,28.04 8.38,27.53 2.9,29.72 2.79,30.43 2.79,30.94 2.79,31.6 2.79,32.11 2.79,32.77 2.79,33.27 3.2,33.27 3.2,32.77 3.2,32.11 3.2,31.6 3.2,30.94 3.2,30.43 3.2,33.68 2.79,33.68 3,32.41 3,31.24 9.7,35.1 9.3,35.1 9.7,34.7 9.3,34.7 9.7,34.24 9.3,34.24 9.7,33.83 9.3,33.83 8.89,33.83 8.89,34.24 7.57,19.76 8.53,16.92 16.41,14.02 16.31,17.63 16.56,18.24 16.66,6.76 14.83,8.59 0.76,45.92 1.42,45.92 0.76,46.58 4.52,49.99 0.76,4.78 0.76,4.11 1.42,4.11 1.42,4.78 4.52,3.61 5.03,3.61 5.54,3.61 6.05,3.61 6.55,3.61 7.06,3.61 11.48,0.41 11.48,2.03 11.89,2.03 12.29,2.03 11.89,0.41 12.29,0.41 18.64,0.81 18.64,1.32 14.22,0.81 3.2,17.12 3.2,17.78 15.04,4.06 12.5,4.11 2.54,4.42 16.61,23.16 16.36,23.62 19.61,17.68 12.7,0.41 13.11,0.41 13.51,0.41 13.92,0.41 14.33,0.41 14.73,0.41 15.14,0.41 17.58,0.41 17.98,0.41 18.39,0.41 18.8,0.41 19.2,0.41 19.61,0.41 20.02,0.41 20.42,0.41 20.83,0.51 12.7,2.03 14.22,1.32 14.22,1.83 18.64,1.83 18.64,2.34 18.64,2.84 18.19,3.1 17.68,3.1 14.63,4.06 15.44,4.06 13.06,5.64 6.81,12.8 9.91,19 13.26,20.47 16.05,45.16 21.95,44.96 21.95,45.92 15.75,43.99 3.3,4.37 2.54,12.7 13.82,5.59 8.08,7.06 8.08,7.72 7.16,7.11 12.6,7.87 19.81,8.13 7.57,3.61 8.08,3.61 8.59,3.61 9.09,3.61 9.6,3.61 10.11,3.61 10.62,3.61 11.13,3.61 11.48,2.49 11.48,3.3 11.48,2.9
  pour Bottom (rank 2, no thermals): 8.13,35.31 9.91,35.31 9.91,33.17 8.99,33.17 8.53,33.63 8.53,34.24 8.13,34.65
  pour Top (rank 4, no thermals): 0,50.8 0,3.45 11.23,3.45 11.23,0 24.13,0 24.13,50.8
  pour Layer3-signal (no thermals): 0,3.45 11.28,3.45 11.28,0 26.67,0 26.67,50.8 0,50.8
  pour Layer4-signal (rank 3, no thermals): 0,3.45 11.28,3.45 11.28,0 27.94,0 27.94,50.8 0,50.8
  pour Layer5-signal (rank 3, no thermals): 0,3.45 11.28,3.45 11.28,0 29.21,0 29.21,50.8 0,50.8
  pour Layer6-signal (no thermals): 0,3.45 11.28,3.45 11.28,0 30.48,0 30.48,50.8 0,50.8
  pour Bottom (rank 3, no thermals): 0,3.45 11.23,3.45 11.23,0 33.02,0 33.02,50.8 0,50.8
  pour Layer2-gnd (no thermals): 11.28,0 25.4,0 25.4,50.8 0,50.8 0,3.45 11.28,3.45
  pour Layer7-gnd (no thermals): 11.28,0 31.75,0 31.75,50.8 0,50.8 0,3.45 11.28,3.45
ILIM
  Bottom 0.203: U14.10 6.85,38.97 6.15,39.67 R33.1
MFF2_CLK
  Bottom 0.178: U7.6 8.89,26.32 7.96,26.32 7.82,26.18 7.82,25.25 7.41,24.84 6.23,24.84 5.94,24.55 U4.7
  Bottom 0.203: C4.1 U7.6
MFF2_DATA
  Bottom 0.178: U4.11 7.16,22.55 7.49,22.55 7.62,22.43 8.71,22.43 9.43,21.71 U7.3
  Bottom 0.203: C5.1 U7.3
MFF2_RST
  Bottom 0.152: C14.1 10.9,28.42 10.77,28.55 8.23,28.55 7.21,27.53 6.38,27.53 6.13,27.29 6.13,26.02 5.28,25.17 3,25.17 2.72,24.89 2.72,23.83 3.15,23.39 3.5,23.39 3.73,23.16 U4.3
  Bottom 0.203: C14.1 U7.7
MFF2_VSIM
  Bottom 0.152: C49.1 11.71,28.04 10.9,28.85 7.99,28.85 6.97,27.84 6.25,27.84 5.82,27.41 5.82,26.14 5.15,25.47 2.88,25.47 2.42,25.01 2.42,23.36 2.21,23.16 2.21,22.23 2.72,21.72 2.72,18.87 3.08,18.52 3.69,18.52 3.91,18.75 3.91,19.02 5.44,20.55 U4.15
  Bottom 0.203: C49.1 12.12,27.11 U7.8
N$6  (via drill 0.2)  (8 unrouted)
  other vias: 3.05,6.15 3.51,6.15 3.05,6.55 3.51,6.55 3.05,6.96 3.51,6.96 4.93,7.01 4.93,6.6 4.93,6.2
  pour Top (no thermals): 5.23,5.89 5.23,8.69 2.79,8.69 2.79,5.89
  pour Bottom (no thermals): 4.88,5.89 4.88,7.21 2.79,7.21 2.79,5.89
N$9  (via drill 2.54)
  other vias: 2.54,48.26
N$10  (via drill 2.54)
  other vias: 20.32,48.26
N$12
  cutout Layer2-gnd: 7.42,6.45 7.42,3.51 11.23,3.51 11.23,2.54 15.44,2.54 15.44,0 17.27,0 17.27,4.57 8.84,4.57 8.84,6.45
N$13
  cutout Layer7-gnd: 17.27,0 17.27,4.67 16.41,5.54 14.27,5.54 14.27,6.91 13.87,7.32 12.19,7.32 10.92,8.48 10.92,10.46 10.21,10.46 10.21,8.99 10.11,8.89 10.11,7.62 11.07,6.65 12.14,6.65 12.34,6.45 12.95,6.45 13.26,6.15 13.26,5.38 13,5.13 13,3.56 12.95,3.51 0.15,3.51 0.15,0
N$16
  Top 0.203: R44.1 6.1,46.97 D5.A
N$23
  Bottom 0.203: U1.4 19.15,32.5 19.52,32.5 R1.2
N$25
  pour Bottom (no thermals): 17.22,31.65 17.22,31.29 16.87,31.29 16.56,30.99 13.21,30.99 13.21,32.21 16.26,32.21 16.76,31.7 17.22,31.7
N$41
  Bottom 0.203: R28.1 8.06,42.77 C54.1 7.89,42.93 U13.3
N$42
  Bottom 0.203: R29.1 8.81,43.51 C55.1 7.95,43.43 U13.2
NANO_CLK  (via drill 0.2)
  Top 0.152: C15.1 v19.36,44.48
  Layer3-signal 0.15: 7.82,23.67 v7.66,23.67
  Layer3-signal 0.152: v7.66,23.67 7.83,23.85 7.86,23.85 10.82,26.81 10.82,35.94 9.65,37.11 9.65,42.52 11.62,44.48 v19.36,44.48
  Bottom 0.152: U4.9 7.64,23.66 v7.66,23.67 | 21.73,43.36 CONN1.C3 | CONN1.C3 | v19.36,44.48 20.2,43.63 CONN1.C3
NANO_DATA  (via drill 0.2)
  Top 0.152: C16.1 15.09,43.59 v15.24,43.43
  Layer3-signal 0.15: v7.7,21.24 7.88,21.41 7.9,21.41 8.64,22.15 8.64,23.98
  Layer3-signal 0.152: v19.51,41.1 18.24,42.37 16.31,42.37 v15.24,43.43 14.56,44.12 11.68,44.12 9.96,42.39 9.96,37.24 11.12,36.07 11.12,26.47 8.64,23.98 | 7.76,21.18 v7.7,21.24
  Bottom 0.152: v7.7,21.24 7.29,21.24 7.24,21.29 6.7,21.29 U4.13 | v19.51,41.1 19.51,41.46 19.33,41.64 18.68,42.29 11.75,42.29 CONN1.C7
NANO_RST  (via drill 0.2)
  Top 0.152: C6.1 v17.83,43.54
  Layer5-signal 0.152: v3.2,24.69 3.2,24.75 8.28,29.82 14.62,29.82 17.88,33.08 17.88,35.94 19.71,37.77 19.71,39.44 20.73,40.46 20.73,41.76 19.09,43.39 17.97,43.39 v17.83,43.54
  Bottom 0.152: U4.5 4.53,24.69 v3.2,24.69 | CONN1.C2 19.57,43.54 v17.83,43.54
NANO_VSIM  (via drill 0.2)
  Top 0.152: C50.1 v17.02,43.54
  Layer5-signal 0.152: v3.33,20.12 3.86,20.66 3.86,24.97 8.4,29.52 14.76,29.52 18.19,32.95 18.19,35.81 20.02,37.64 20.02,39.06 21.23,40.28 21.23,41.76 19.3,43.7 19.03,43.7 18.58,44.15 17.63,44.15 v17.02,43.54
  Bottom 0.152: 21.87,38.69 21.73,38.56 | U4.1 4.33,21.12 v3.33,20.12 | CONN1.C1 20.78,39.78 20.78,41.7 19.42,43.05 17.45,43.05 17.02,43.48 v17.02,43.54
  Bottom 0.203: 21.87,38.69 CONN1.C1
NRF_USB_NN  (via drill 0.2)
  Top 0.152: v12.08,46.13 12.08,45.19 11.76,44.87 11.76,44.61 11.2,44.05
  Layer3-signal 0.152: v2.95,35.41 3.12,35.59 3.15,35.59 7.47,39.91 7.47,43.13 10.95,46.61 11.62,46.61 12.08,46.15
  Layer3-signal 0.203: 12.08,46.15 v12.08,46.13
  Bottom 0.152: U14.3 3.22,35.67 3.15,35.59 3.12,35.59 v2.95,35.41
NRF_USB_PP  (via drill 0.2)
  Top 0.203: v11.43,46.13 v11.42,46.13
  Layer3-signal 0.152: v2.29,35.36 2.32,35.36 2.75,34.93 3.15,34.93 4.65,36.43 4.65,36.65 7.77,39.78 7.77,42.48 v11.42,46.13
  Bottom 0.152: U14.2 3.38,35.17 3.15,34.93 2.71,34.93 v2.29,35.36
OTG
  Bottom 0.203: U14.8 5.85,38.74 4.78,39.82 R7.2
P0.24/SDA  (via drill 0.2)
  Top 0.152: v4.98,44.91 3.66,44.91 2.87,44.12 2.87,40.94 2.67,40.74 2.67,40.34 2.87,40.14 2.87,38.45 3.33,37.99 3.33,37.77 v3.5,37.59
  Layer4-signal 0.152: v15.65,10.42 15.78,10.42 17.4,12.04 17.4,12.65 17.37,12.67 17.37,22.35 17.66,22.63 17.66,23.24 15.14,25.76 13.26,25.76 12.88,26.14 12.78,26.24 12.78,26.93 15.19,29.34 15.19,42.52 14.58,43.13 14.58,43.74 14.88,44.04 14.88,46.63 14.02,47.5 7.57,47.5 v4.98,44.91
  Bottom 0.152: U14.6 3.93,37.17 v3.5,37.59 | v15.65,10.42 15.41,10.42 15.19,10.65 | 14.98,10.85 | 14.98,10.85 15.19,10.65 | 15.19,10.65
  Bottom 0.203: v4.98,44.91 4.95,44.88 R36.2 4.09,44.6 U13.8
P1.09/SCL  (via drill 0.2)
  Top 0.152: v2.9,44.91 2.9,44.58 2.46,44.15 2.46,40.97 2.36,40.86 2.36,39.86 2.39,39.83 2.49,39.73 2.49,38.12 2.37,37.99 2.37,37.36 v3,36.73
  Layer6-signal 0.152: v3,36.73 3.96,35.76 3.96,33.98 5.38,32.56 5.38,29.3 11.71,22.98 11.71,20.35 v12.3,19.76
  Bottom 0.152: 3.48,44.91 R30.2 | v3,36.73 3.06,36.67 U14.5 | 12.38,16.05 12.38,19.68 v12.3,19.76
  Bottom 0.203: v2.9,44.91 3.48,44.91 | U13.7 3.56,43.43 3.43,43.56 3.43,44.19 3.5,44.26 R30.2
PMIC_SYS  (via drill 0.2)
  Top 0.203: v9.25,35.92 10.16,36.83 10.16,39.06 10.01,39.21 7.72,39.21 7.52,39.41 7.52,42.82 6,44.34 6,46.31 R44.2
  Bottom 0.152: R4.2 15.54,26.68 U2.5
  Bottom 0.203: U14.16 8.83,35.92 v9.25,35.92
  pour Bottom (no thermals): 8.53,35.56 10.16,35.56 10.41,35.31 10.72,35 10.72,29.67 12.85,29.67 12.85,34.75 11.28,36.32 8.18,36.32 8.18,35.56
  pour Bottom (no thermals): 17.58,27.03 14.63,27.03 13.97,27.69 13.97,28.7 13.16,29.51 10.72,29.51 10.72,30.68 15.7,30.68 15.7,29.16 16.71,29.16 16.71,28.19 17.58,28.19
PMID
  Bottom 0.203: U14.23 5.85,32.98 5.49,32.61 5.49,29.72 5.28,29.52
  Bottom 0.406: 5.28,29.52 4.56,29.52 C56.1
  Bottom 0.61: C62.1 C56.1
REGN  (via drill 0.2)
  Layer6-signal 0.152: v6.35,32.31 4.27,34.4 4.27,40.08 5.41,41.22 v6.96,41.22
  Bottom 0.203: U14.22 v6.35,32.31 6.35,31.84 C65.1 | v6.96,41.22 R35.1
SIM_CLK  (via drill 0.2)
  Top 0.152: 6.45,22.77 6.96,23.28 6.96,23.66 7.46,24.15 7.48,24.15 v7.66,24.33
  Bottom 0.152: U4.8 7.6,24.28 v7.66,24.33
SIM_IO  (via drill 0.2)
  Top 0.152: v7.7,21.89 4.48,21.89
  Bottom 0.152: U4.12 7.44,22.16 v7.7,21.89
SIM_RST  (via drill 0.2)
  Top 0.152: v3.2,24.03 2.62,23.44 2.49,23.44 2.21,23.16 2.21,22.46 4.1,20.57
  Bottom 0.152: U4.4 3.87,23.66 3.5,24.03 v3.2,24.03
SIM_SELECT  (via drill 0.2)
  Top 0.152: v10.26,20.93 10.44,21.11 10.44,21.13 11.16,21.84 14.12,21.84 15.83,23.55
  Layer6-signal 0.152: v10.26,20.93 9.86,20.93 8.18,19.25 6.1,19.25 v3.2,22.15
  Bottom 0.203: R15.2 v3.2,22.15 R14.1 3.48,22.43 3.71,22.66 U4.2
SIM_VCC  (via drill 0.2)
  Top 0.152: 3.73,19.47 v3.7,19.5
  Bottom 0.152: U4.16 4.94,20.48 3.96,19.5 v3.7,19.5
STAT  (via drill 0.2)
  Top 0.203: D5.C 6.1,49.58 v6.71,48.97
  Layer3-signal 0.2: v2.95,36.07 3.1,36.22 3.21,36.22 3.61,36.62 3.61,36.98
  Layer3-signal 0.203: v6.71,48.97 6.71,46.99 8.03,45.67 8.03,44.24 5.54,41.75 5.54,38.91 3.61,36.98
  Bottom 0.152: U14.4 4.13,36.17 4.04,36.07 v2.95,36.07
SW1
  pour Bottom (no thermals): 7.92,34.39 8.23,34.09 8.23,33.48 8.79,32.92 9.5,32.92 9.65,32.77 9.65,29.51 7.87,29.51 7.87,30.78 7.62,31.04 7.32,31.04 7.21,31.14 7.21,31.5 7.67,31.5 7.77,31.6 7.77,32.36 7.26,32.87 7.26,34.39
SYS_PWR_EN  (via drill 0.2)
  Layer4-signal 0.152: 21.59,31.29 20.42,30.12 20.42,25.43 v20.12,25.12
  Bottom 0.152: U2.4 17.77,25.92 18.44,25.25 19.99,25.25 v20.12,25.12
  Bottom 0.254: U2.4 15.55,25.92 R4.1
TS
  Bottom 0.203: U14.12 | U14.12 7.85,39.72 R34.1 R35.2 | U14.11 U14.12
V_INT  (via drill 0.2)
  Top 0.152: 18.68,9.27 19.81,9.27 19.81,8.9 v19.77,8.87
  Layer3-signal 0.152: v21.18,4.83 20.39,5.62 20.39,8.25 v19.77,8.87 19.43,8.87 18.9,8.33 18.9,7.24 17.3,5.64 15.61,5.64 14.87,6.38 11.86,6.38 10.92,7.32 9.25,7.32 8.24,8.33 7.57,8.33 2.69,13.21 v2.69,22.96
  Layer4-signal 0.152: v3.33,26.59 3.76,26.16 3.76,23.37 3.35,22.96 v2.69,22.96
  Layer6-signal 0.203: v7.57,20.47 5.08,22.96 v2.69,22.96
  Bottom 0.152: v21.18,4.83 20.6,4.25 19.84,4.25 19.38,3.79 18.89,3.79 18.71,3.6 18.31,3.6 18.03,3.88 18.03,4.44 18.22,4.63 18.22,5.1 17.14,6.17 17.14,7 16.91,7.24 16.77,7.24 | R14.2 2.72,22.99 v2.69,22.96
  Bottom 0.203: U4.14 5.94,20.6 C43.1 6.07,20.47 v7.57,20.47
VBUS_NRF
  pour Top (no thermals): 12.55,47.09 12.55,45.21 12.09,44.75 12.09,43.54 10.72,42.16 10.72,41.4 12.85,41.4 14.38,42.93 14.38,44.75 13.31,45.82 13.31,47.09
VIN  (via drill 0.2)  (10 unrouted)
  Top 0.152: D4.CATHODE 11.84,39.83 v11.99,39.67
  Layer3-signal 0.203: v11.99,40.18 v11.48,40.18 11.48,39.78
  Layer3-signal 1.016: 18.31,28.07 18.13,28.07 18.11,28.04 17.02,28.04 | 17.02,28.04 | 17.02,28.04 16.46,28.04 16.15,28.35
  Layer3-signal 1.27: 20.88,29.21 19.73,28.07 18.31,28.07 | 16.15,28.35 15.19,29.31 15.19,34.45 15.22,34.47 15.22,35.33 15.19,35.36 15.19,37.54 13.56,39.17 v11.99,39.17 v11.99,40.69 v11.48,40.69 11.48,39.78 v11.48,39.17
  Layer5-signal 0.203: v11.99,39.67 v11.48,39.67 v11.48,40.18
  Layer5-signal 1.27: v4.62,31.24 4.62,34.56 4.61,34.56 4.61,38.7 6.1,40.18 v11.48,40.18
  other vias: 4.62,30.84 4.22,30.84 4.22,31.24 4.62,31.65 4.22,31.65
  pour Bottom (no thermals): 4.88,30.12 3.81,30.12 3.81,34.75 5.03,34.75 5.54,34.24 5.54,33.53 5.03,33.02 5.03,30.73 5.03,30.12 4.93,30.12
  pour Layer5-signal: 12.45,38.66 11.02,38.66 11.02,40.94 12.45,40.94
  pour Layer5-signal: 3.96,30.12 3.96,31.9 5.49,31.9 5.49,30.12
VSYS  (via drill 0.2)  (26 unrouted)
  Layer5-signal 0.203: 5.89,12.04 5.89,11.94 v5.69,11.94
  Layer5-signal 1.016: 18.34,28.09 18.16,28.09 18.11,28.04 17.63,28.04 17.5,27.92
  Layer5-signal 1.27: v19.25,30.89 19.25,28.65 18.69,28.09 18.34,28.09 | 17.5,27.92 15.14,25.55 6.6,25.55 4.74,23.69 4.74,13.19 5.89,12.04
  Bottom 0.152: R1.1 19.71,32.94 19.86,32.94 19.99,32.81 19.99,32.27 19.86,32.13 19.74,32.13 19.51,31.9 19.51,31.5
  other vias: 6.1,13.11 6.1,12.7 6.1,12.29 5.69,12.29 5.69,12.7 5.69,13.11 19.71,31.34 19.71,30.89 19.71,30.43 19.71,29.97 19.71,29.51 18.8,30.43 18.8,30.89 18.8,29.97 19.25,31.34 19.25,30.43 19.25,29.97 18.85,29.51 18.85,31.34 6.1,11.94 19.25,29.51
  pour Bottom (no thermals): 19.96,27.43 18.44,27.43 18.44,31.6 19.96,31.6
  pour Bottom (no thermals): 4.98,7.52 3.71,7.52 3.71,8.64 4.27,8.64 4.27,11.84 3.56,11.84 3.56,13.61 6.3,13.61 6.3,11.84 5.99,11.53 5.28,11.53 4.98,11.23

### Text on the board
tPlace: +
bPlace: NFC | v1.00 | BT